# EAGLE design registers_miniboard_autorouted (EAGLE 9.5.2)
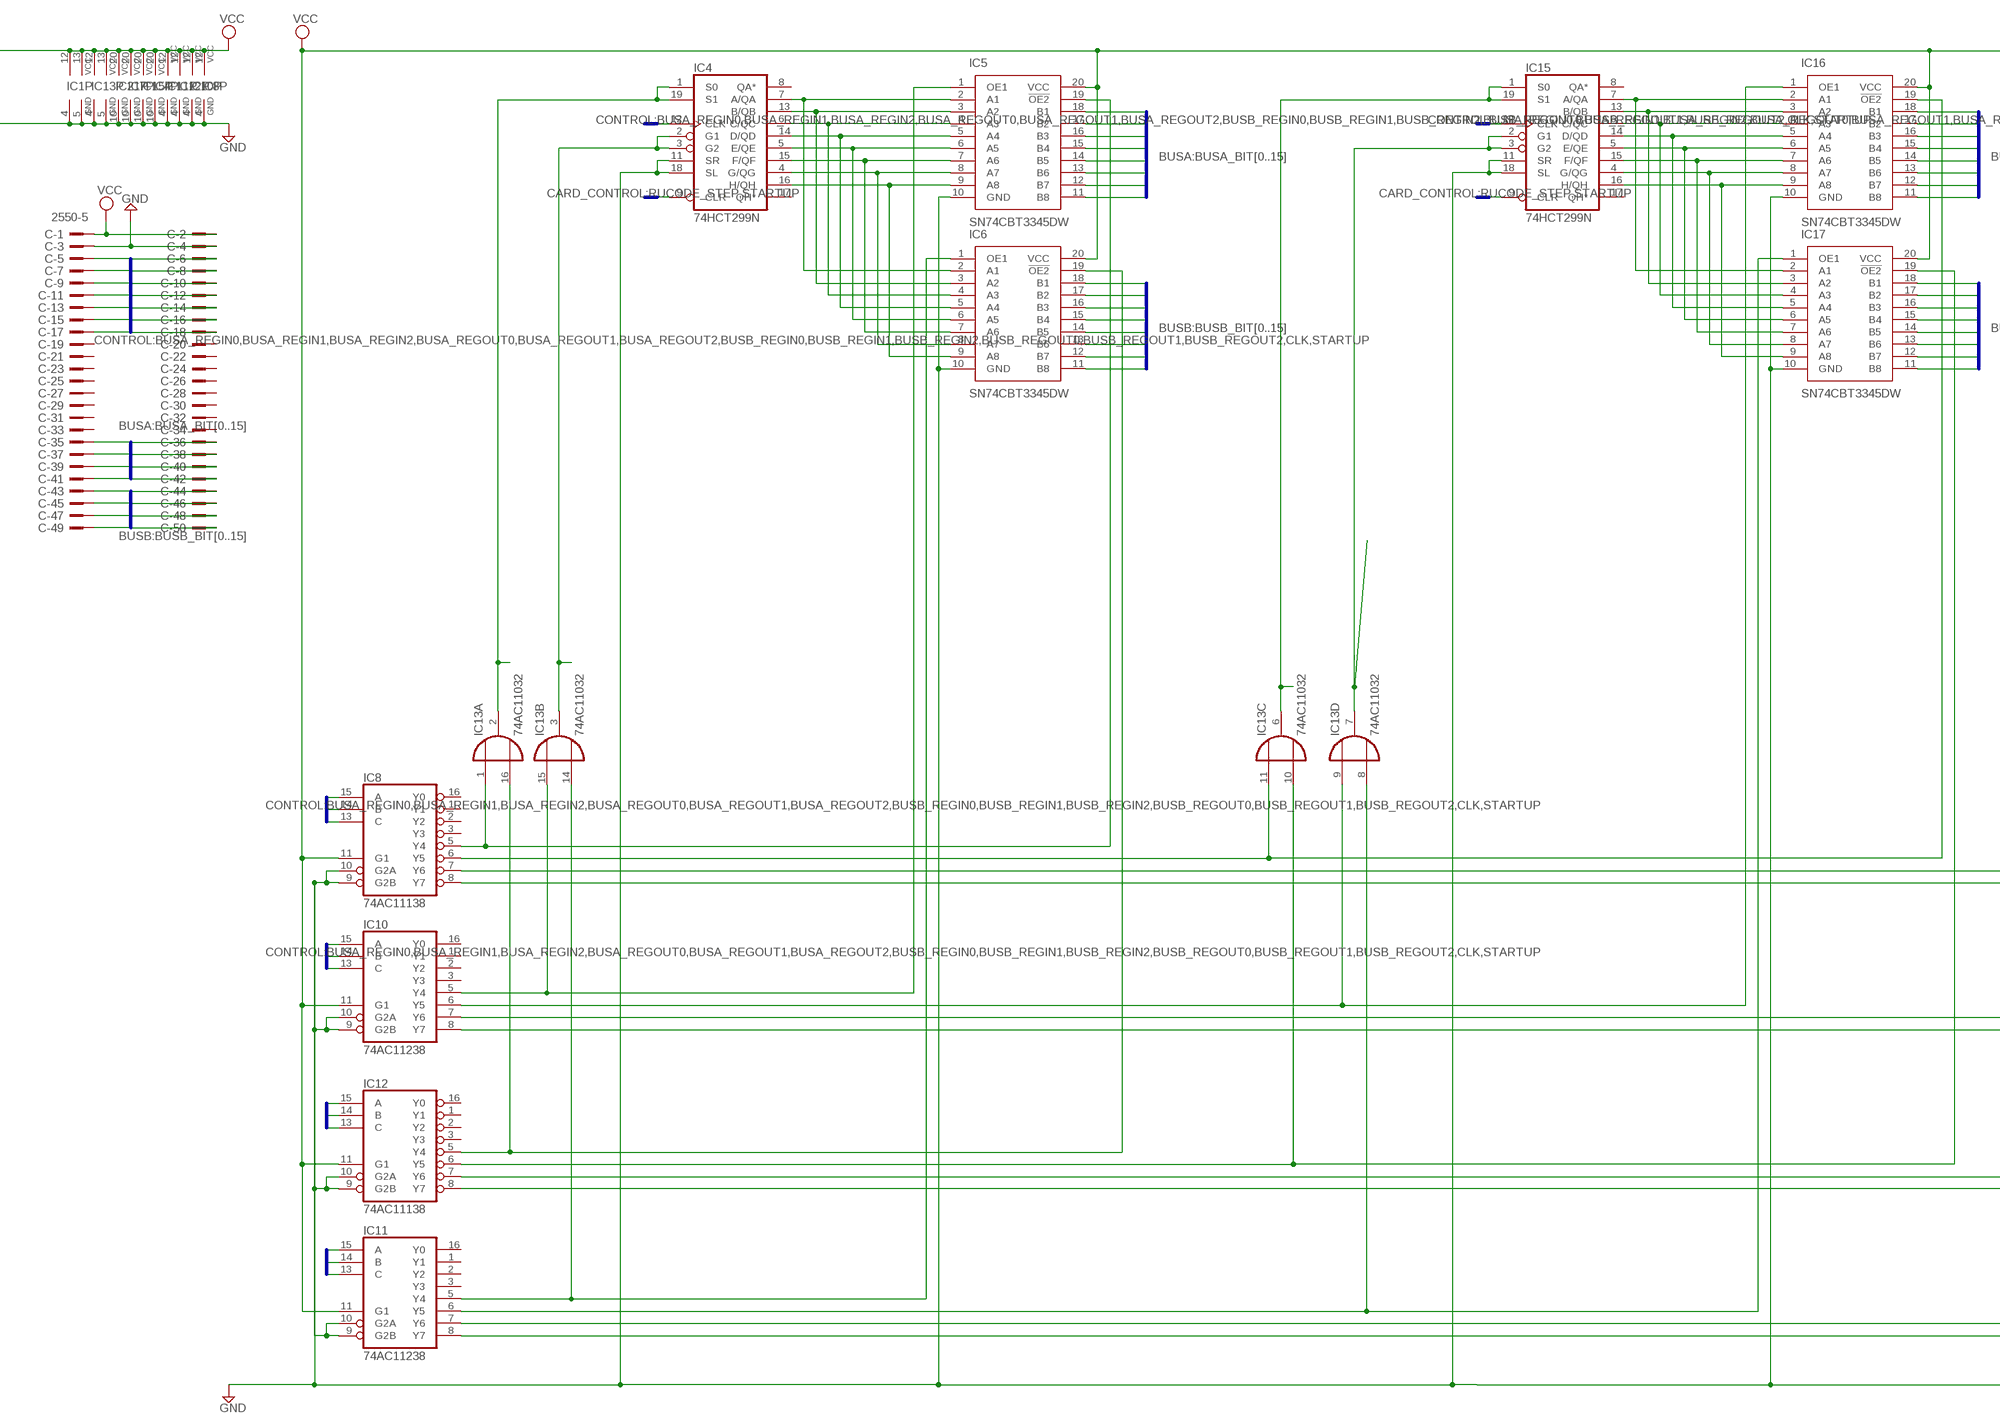
[diagram p0: schematic, sheet 1, part 1 of 2]
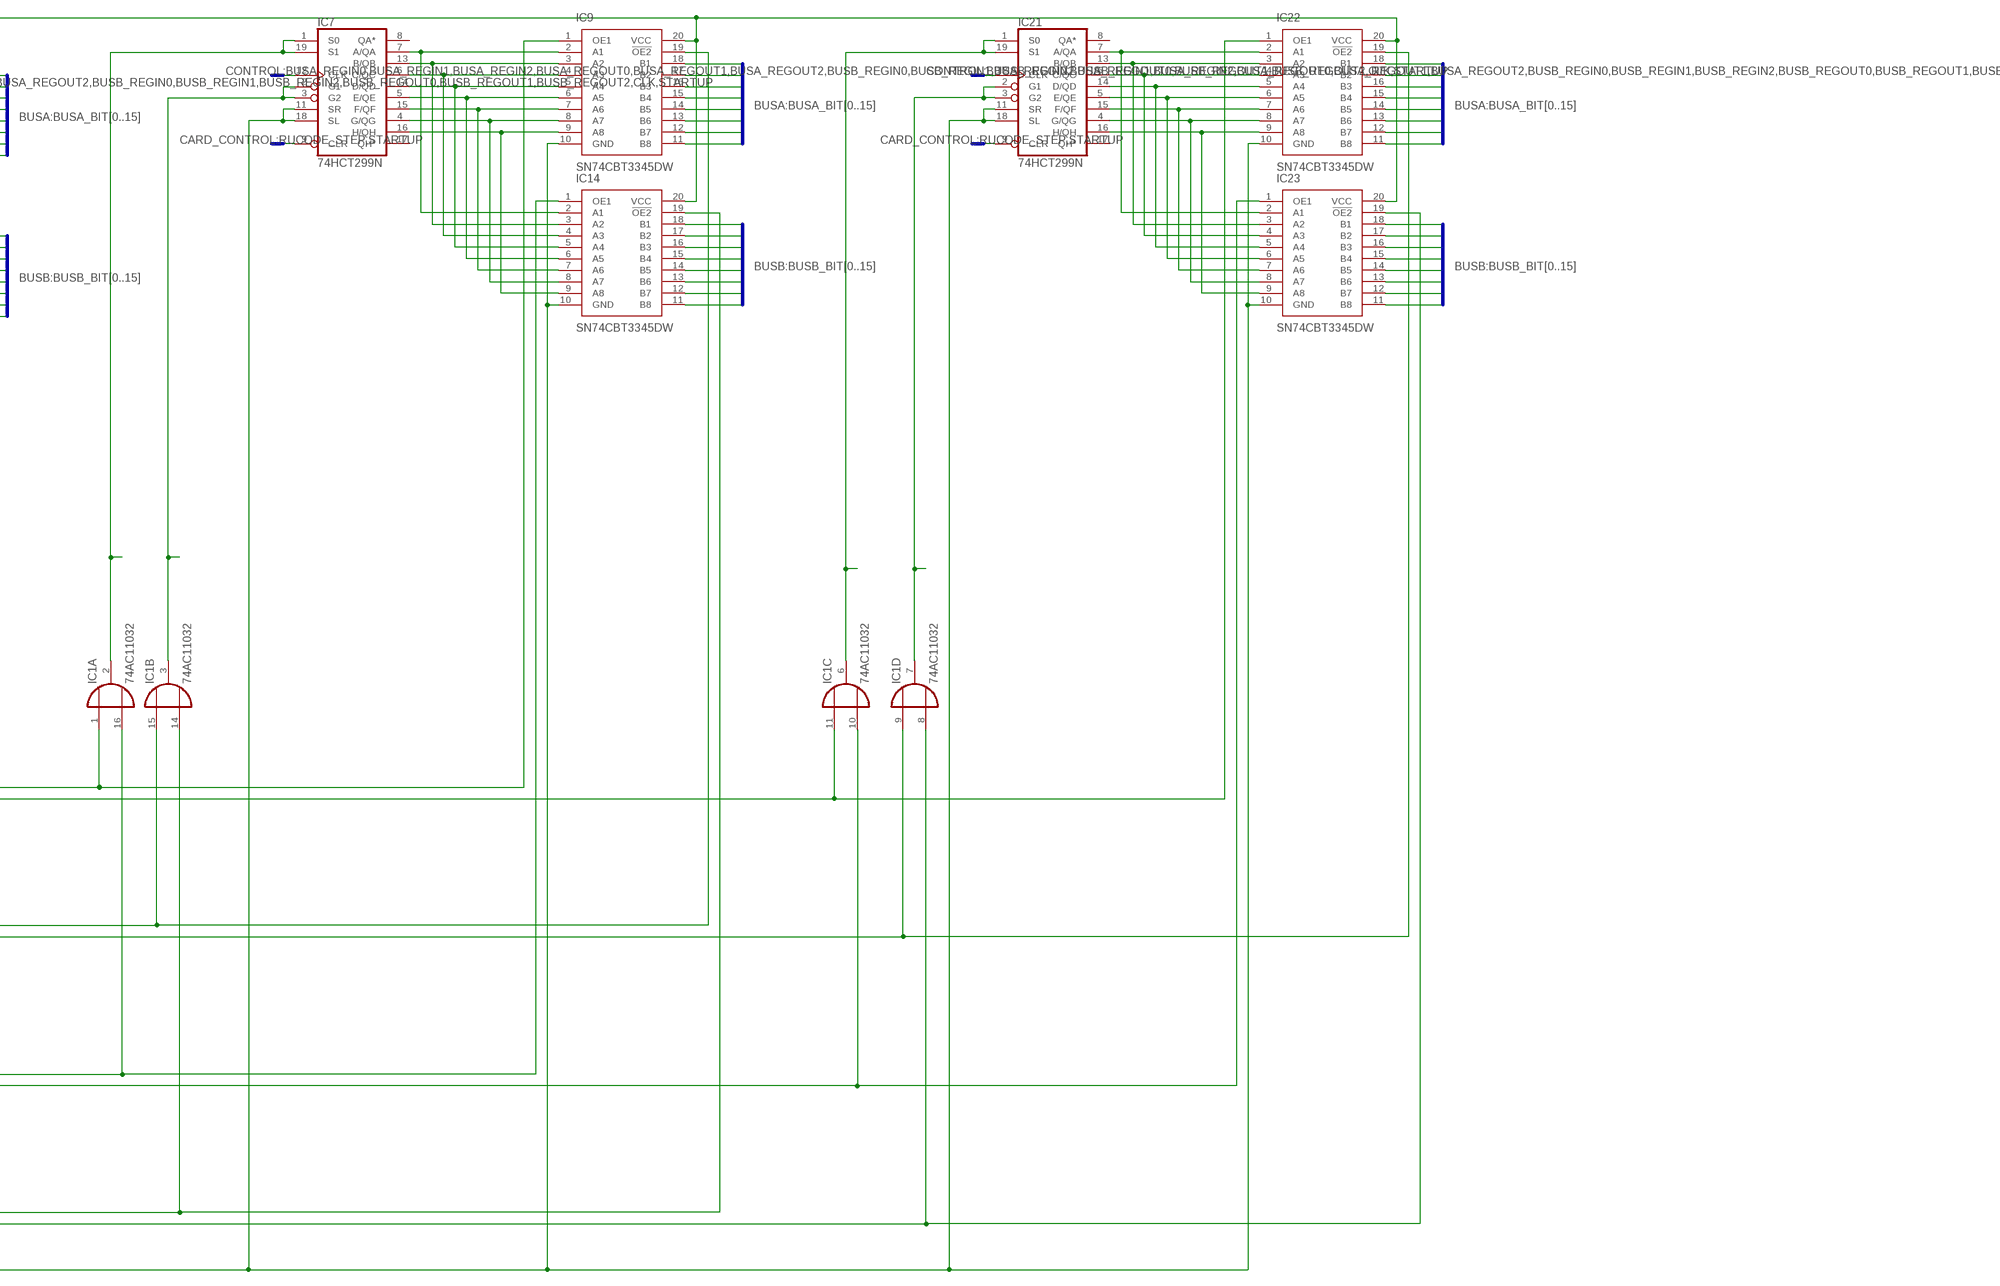
[diagram p1: schematic, sheet 1, part 2 of 2]

## Parts
C  2550-5  [PAK100/2500-5-50]
IC1  74AC11032  [DIL16]
IC4  74HCT299N  [DIL20]
IC5  SN74CBT3345DW  [SOIC127P1030X265-20N]
IC6  SN74CBT3345DW  [SOIC127P1030X265-20N]
IC7  74HCT299N  [DIL20]
IC8  74AC11138  [DIL16]
IC9  SN74CBT3345DW  [SOIC127P1030X265-20N]
IC10  74AC11238  [DIL16]
IC11  74AC11238  [DIL16]
IC12  74AC11138  [DIL16]
IC13  74AC11032  [DIL16]
IC14  SN74CBT3345DW  [SOIC127P1030X265-20N]
IC15  74HCT299N  [DIL20]
IC16  SN74CBT3345DW  [SOIC127P1030X265-20N]
IC17  SN74CBT3345DW  [SOIC127P1030X265-20N]
IC21  74HCT299N  [DIL20]
IC22  SN74CBT3345DW  [SOIC127P1030X265-20N]
IC23  SN74CBT3345DW  [SOIC127P1030X265-20N]

## Nets
BUSA_BIT0: C.35 IC5.18(B1) IC9.18(B1) IC16.18(B1) IC22.18(B1)
BUSA_BIT1: C.36 IC5.17(B2) IC9.17(B2) IC16.17(B2) IC22.17(B2)
BUSA_BIT2: C.37 IC5.16(B3) IC9.16(B3) IC16.16(B3) IC22.16(B3)
BUSA_BIT3: C.38 IC5.15(B4) IC9.15(B4) IC16.15(B4) IC22.15(B4)
BUSA_BIT4: C.39 IC5.14(B5) IC9.14(B5) IC16.14(B5) IC22.14(B5)
BUSA_BIT5: C.40 IC5.13(B6) IC9.13(B6) IC16.13(B6) IC22.13(B6)
BUSA_BIT6: C.41 IC5.12(B7) IC9.12(B7) IC16.12(B7) IC22.12(B7)
BUSA_BIT7: C.42 IC5.11(B8) IC9.11(B8) IC16.11(B8) IC22.11(B8)
BUSA_REGIN0: C.7 IC8.15(A)
BUSA_REGIN1: C.9 IC8.14(B)
BUSA_REGIN2: C.11 IC8.13(C)
BUSA_REGOUT0: C.13 IC10.15(A)
BUSA_REGOUT1: C.15 IC10.14(B)
BUSA_REGOUT2: C.17 IC10.13(C)
BUSB_BIT0: C.43 IC6.18(B1) IC14.18(B1) IC17.18(B1) IC23.18(B1)
BUSB_BIT1: C.44 IC6.17(B2) IC14.17(B2) IC17.17(B2) IC23.17(B2)
BUSB_BIT2: C.45 IC6.16(B3) IC14.16(B3) IC17.16(B3) IC23.16(B3)
BUSB_BIT3: C.46 IC6.15(B4) IC14.15(B4) IC17.15(B4) IC23.15(B4)
BUSB_BIT4: C.47 IC6.14(B5) IC14.14(B5) IC17.14(B5) IC23.14(B5)
BUSB_BIT5: C.48 IC6.13(B6) IC14.13(B6) IC17.13(B6) IC23.13(B6)
BUSB_BIT6: C.49 IC6.12(B7) IC14.12(B7) IC17.12(B7) IC23.12(B7)
BUSB_BIT7: C.50 IC6.11(B8) IC14.11(B8) IC17.11(B8) IC23.11(B8)
BUSB_REGIN0: C.8 IC12.15(A)
BUSB_REGIN1: C.10 IC12.14(B)
BUSB_REGIN2: C.12 IC12.13(C)
BUSB_REGOUT0: C.14 IC11.15(A)
BUSB_REGOUT1: C.16 IC11.14(B)
BUSB_REGOUT2: C.18 IC11.13(C)
CLK: C.5 IC4.12(CLK) IC7.12(CLK) IC15.12(CLK) IC21.12(CLK)
GND: C.3 C.4 IC1.4(P:GND) IC1.5(P:GND) IC4.10(GND) IC4.11(SR) IC4.18(SL) IC5.10(GND) IC6.10(GND) IC7.10(GND) IC7.11(SR) IC7.18(SL) IC8.4(GND) IC8.9(G2B) IC8.10(G2A) IC9.10(GND) IC10.4(GND) IC10.9(G2B) IC10.10(G2A) IC11.4(GND) IC11.9(G2B) IC11.10(G2A) IC12.4(GND) IC12.9(G2B) IC12.10(G2A) IC13.4(P:GND) IC13.5(P:GND) IC14.10(GND) IC15.10(GND) IC15.11(SR) IC15.18(SL) IC16.10(GND) IC17.10(GND) IC21.10(GND) IC21.11(SR) IC21.18(SL) IC22.10(GND) IC23.10(GND)
N$1: IC5.19(!OE2) IC8.5(Y4) IC13.1(A:I1)
N$5: IC4.7(A/QA) IC5.2(A1) IC6.2(A1)
N$6: IC4.13(B/QB) IC5.3(A2) IC6.3(A2)
N$7: IC4.6(C/QC) IC5.4(A3) IC6.4(A3)
N$8: IC4.14(D/QD) IC5.5(A4) IC6.5(A4)
N$9: IC4.5(E/QE) IC5.6(A5) IC6.6(A5)
N$10: IC4.15(F/QF) IC5.7(A6) IC6.7(A6)
N$11: IC4.4(G/QG) IC5.8(A7) IC6.8(A7)
N$15: IC4.16(H/QH) IC5.9(A8) IC6.9(A8)
N$22: IC7.7(A/QA) IC9.2(A1) IC14.2(A1)
N$23: IC7.13(B/QB) IC9.3(A2) IC14.3(A2)
N$24: IC7.6(C/QC) IC9.4(A3) IC14.4(A3)
N$25: IC7.14(D/QD) IC9.5(A4) IC14.5(A4)
N$28: IC7.5(E/QE) IC9.6(A5) IC14.6(A5)
N$34: IC5.1(OE1) IC10.5(Y4) IC13.15(B:I1)
N$35: IC7.15(F/QF) IC9.7(A6) IC14.7(A6)
N$36: IC7.4(G/QG) IC9.8(A7) IC14.8(A7)
N$37: IC7.16(H/QH) IC9.9(A8) IC14.9(A8)
N$41: IC15.7(A/QA) IC16.2(A1) IC17.2(A1)
N$42: IC15.13(B/QB) IC16.3(A2) IC17.3(A2)
N$43: IC15.6(C/QC) IC16.4(A3) IC17.4(A3)
N$44: IC15.14(D/QD) IC16.5(A4) IC17.5(A4)
N$45: IC15.5(E/QE) IC16.6(A5) IC17.6(A5)
N$46: IC15.15(F/QF) IC16.7(A6) IC17.7(A6)
N$47: IC15.4(G/QG) IC16.8(A7) IC17.8(A7)
N$48: IC15.16(H/QH) IC16.9(A8) IC17.9(A8)
N$63: IC21.7(A/QA) IC22.2(A1) IC23.2(A1)
N$64: IC21.13(B/QB) IC22.3(A2) IC23.3(A2)
N$65: IC21.6(C/QC) IC22.4(A3) IC23.4(A3)
N$66: IC21.14(D/QD) IC22.5(A4) IC23.5(A4)
N$67: IC21.5(E/QE) IC22.6(A5) IC23.6(A5)
N$68: IC21.15(F/QF) IC22.7(A6) IC23.7(A6)
N$69: IC21.4(G/QG) IC22.8(A7) IC23.8(A7)
N$70: IC21.16(H/QH) IC22.9(A8) IC23.9(A8)
N$123: IC6.1(OE1) IC11.5(Y4) IC13.14(B:I2)
N$124: IC6.19(!OE2) IC12.5(Y4) IC13.16(A:I2)
N$127: IC4.2(G1) IC4.3(G2) IC13.3(B:O)
N$128: IC4.1(S0) IC4.19(S1) IC13.2(A:O)
N$137: IC13.7(D:O) IC15.2(G1) IC15.3(G2)
N$138: IC13.6(C:O) IC15.1(S0) IC15.19(S1)
N$147: IC1.3(B:O) IC7.2(G1) IC7.3(G2)
N$148: IC1.2(A:O) IC7.1(S0) IC7.19(S1)
N$157: IC1.7(D:O) IC21.2(G1) IC21.3(G2)
N$158: IC1.6(C:O) IC21.1(S0) IC21.19(S1)
N$167: IC8.6(Y5) IC13.11(C:I1) IC16.19(!OE2)
N$168: IC12.6(Y5) IC13.10(C:I2) IC17.19(!OE2)
N$169: IC10.6(Y5) IC13.9(D:I1) IC16.1(OE1)
N$170: IC11.6(Y5) IC13.8(D:I2) IC17.1(OE1)
N$171: IC1.1(A:I1) IC8.7(Y6) IC9.1(OE1)
N$172: IC1.16(A:I2) IC12.7(Y6) IC14.1(OE1)
N$173: IC1.15(B:I1) IC9.19(!OE2) IC10.7(Y6)
N$174: IC1.14(B:I2) IC11.7(Y6) IC14.19(!OE2)
N$175: IC1.11(C:I1) IC8.8(Y7) IC22.1(OE1)
N$176: IC1.9(D:I1) IC10.8(Y7) IC22.19(!OE2)
N$177: IC1.8(D:I2) IC11.8(Y7) IC23.19(!OE2)
N$178: IC1.10(C:I2) IC12.8(Y7) IC23.1(OE1)
STARTUP: C.6 IC4.9(CLR) IC7.9(CLR) IC15.9(CLR) IC21.9(CLR)
VCC: C.1 C.2 IC1.12(P:VCC) IC1.13(P:VCC) IC4.20(VCC) IC5.20(VCC) IC6.20(VCC) IC7.20(VCC) IC8.11(G1) IC8.12(VCC) IC9.20(VCC) IC10.11(G1) IC10.12(VCC) IC11.11(G1) IC11.12(VCC) IC12.11(G1) IC12.12(VCC) IC13.12(P:VCC) IC13.13(P:VCC) IC14.20(VCC) IC15.20(VCC) IC16.20(VCC) IC17.20(VCC) IC21.20(VCC) IC22.20(VCC) IC23.20(VCC)
Unconnected: C.19 C.20 C.21 C.22 C.23 C.24 C.25 C.26 C.27 C.28 C.29 C.30 C.31 C.32 C.33 C.34 IC4.8(QA*) IC4.17(QH*) IC7.8(QA*) IC7.17(QH*) IC8.1(Y1) IC8.2(Y2) IC8.3(Y3) IC8.16(Y0) IC10.1(Y1) IC10.2(Y2) IC10.3(Y3) IC10.16(Y0) IC11.1(Y1) IC11.2(Y2) IC11.3(Y3) IC11.16(Y0) IC12.1(Y1) IC12.2(Y2) IC12.3(Y3) IC12.16(Y0) IC15.8(QA*) IC15.17(QH*) IC21.8(QA*) IC21.17(QH*)

## Buses
CONTROL:BUSA_REGIN0,BUSA_REGIN1,BUSA_REGIN2,BUSA_REGOUT0,BUSA_REGOUT1,BUSA_REGOUT2,BUSB_REGIN0,BUSB_REGIN1,BUSB_REGIN2,BUSB_REGOUT0,BUSB_REGOUT1,BUSB_REGOUT2,CLK,STARTUP
CARD_CONTROL:RUCODE_STEP,STARTUP
BUSA:BUSA_BIT[0..15]
BUSB:BUSB_BIT[0..15]

## Library data of the parts
C = con-3m:2550-: 3M (TM) Pak 100 4-Wall Header Source: 3M; OC_FARNELL: 1788696; OC_NEWARK: unknown
IC1 IC13 = 74ac-logic:74AC11032: Quadruple 2-input OR
IC4 IC7 IC15 IC21 = 74xx-eu:74*299: 8-bit universal SHIFT/STORAGE REGISTER
IC5 IC6 IC9 IC14 IC16 IC17 IC22 IC23 = SamacSys_Parts:SN74CBT3345DW: Texas Instruments SN74CBT3345DW, Bus Switch, 8 x 1:1, 4.5 5.5 V, 20-Pin SOIC Source: Datasheet <https://www.ti.com/lit/ds/symlink/sn74cbt3345.pdf>; DESCRIPTION: Texas Instruments SN74CBT3345DW, Bus Switch, 8 x 1:1, 4.5 5.5 V, 20-Pin SOIC; HEIGHT: 2.65mm; MANUFACTURER_NAME: Texas Instruments; MANUFACTURER_PART_NUMBER: SN74CBT3345DW
IC8 IC12 = 74ac-logic:74AC11138: 3 to 8 line DECODER/DEMULTIPLEXER
IC10 IC11 = 74ac-logic:74AC11238: 3 to 8 line DECODER/DEMULTIPLEXER

## Board
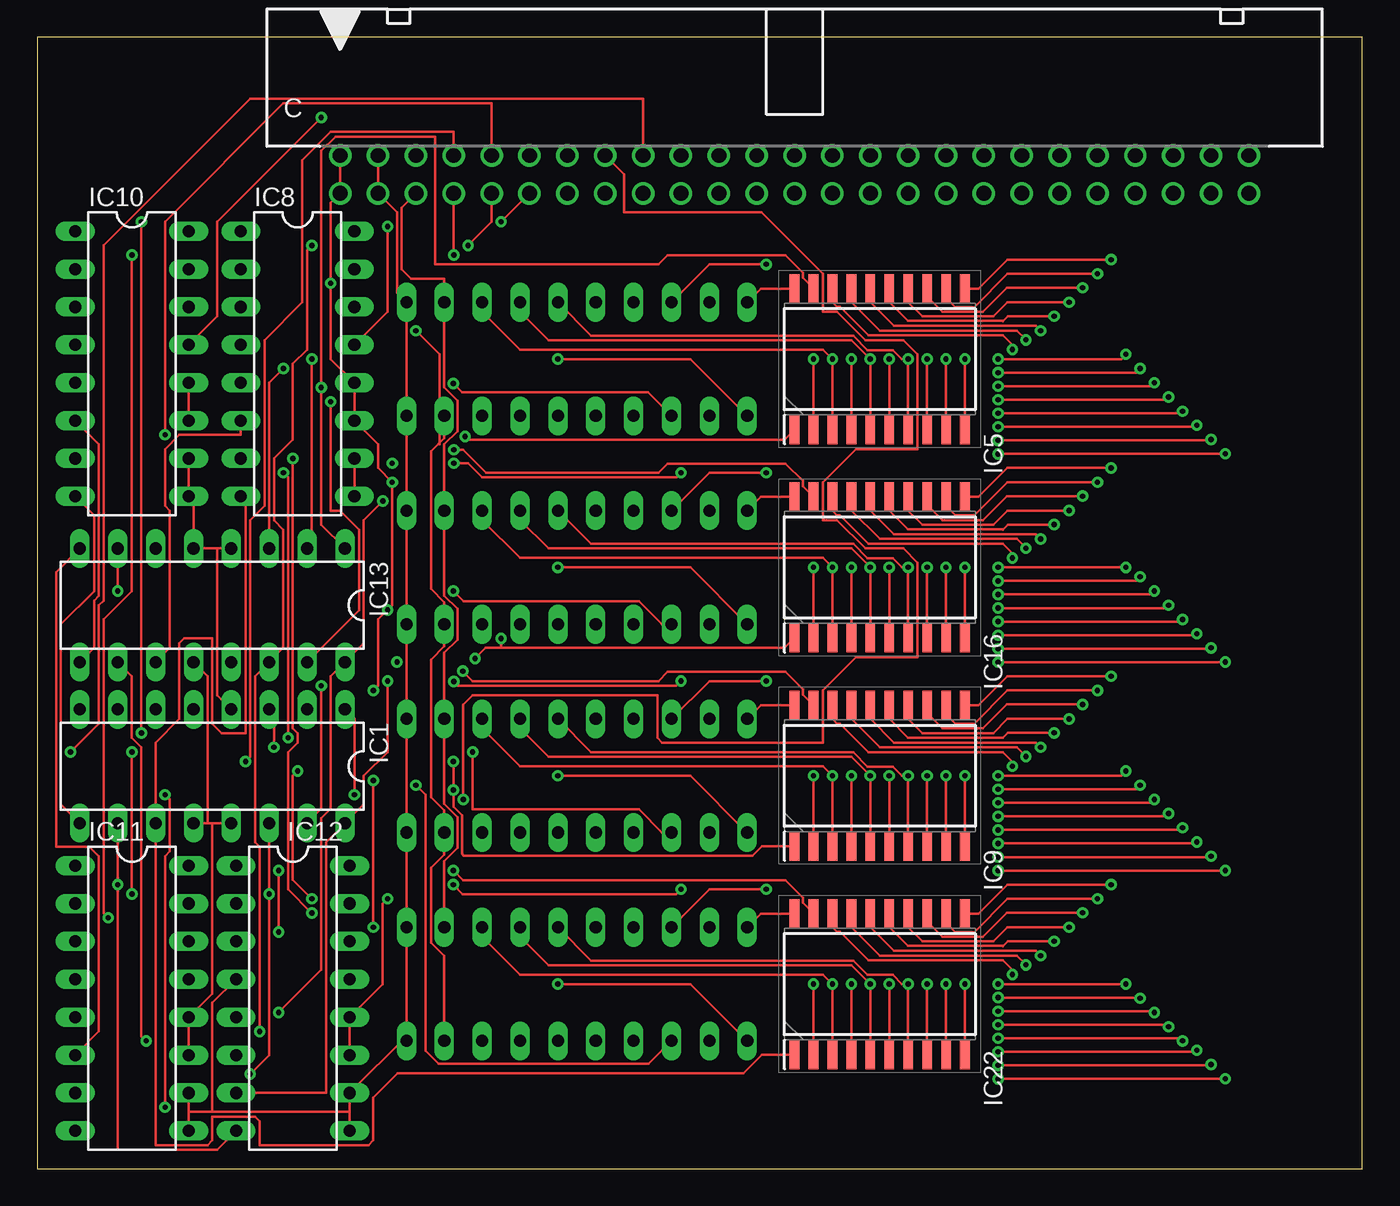
[diagram p2: board, top side]
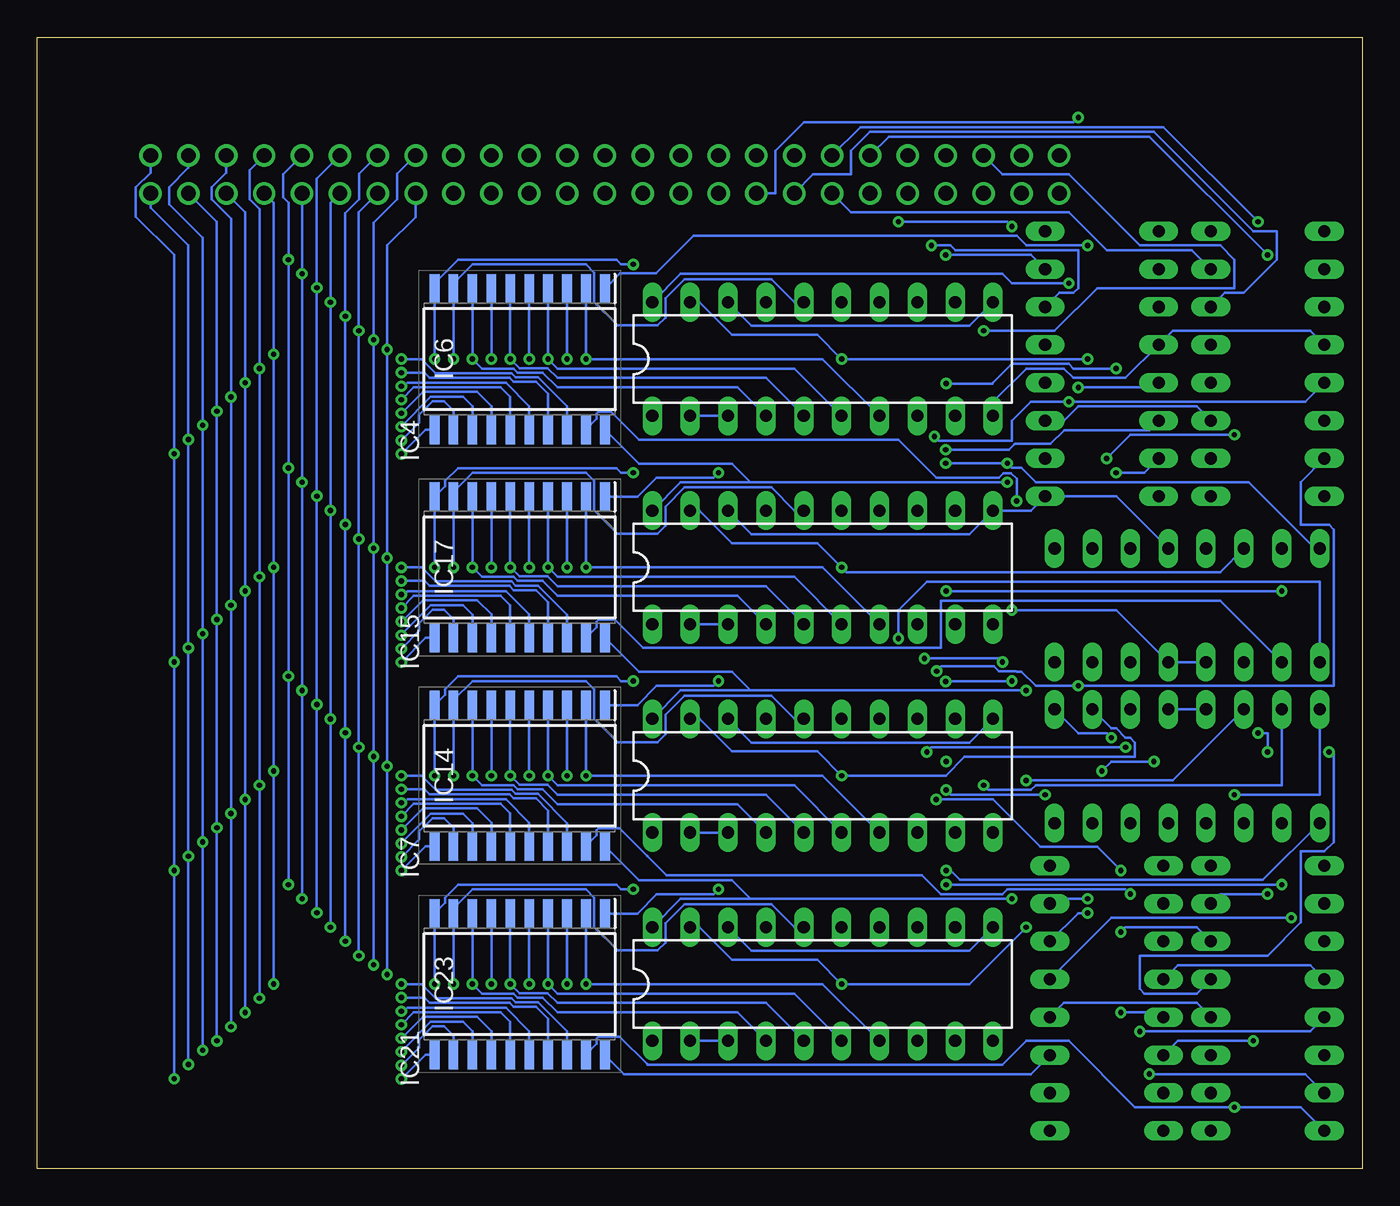
[diagram p3: board, bottom side, seen from below]

Size 88.88 x 75.87 mm. Coordinates in mm from the lower left corner, seen from the top.
Outline: 0,0 88.88,0 88.88,75.87 0,75.87 0,0
Copper layers (1*16): Top 0.035mm / dielectric 1.5mm / Bottom 0.035mm
Design rules "default *": minimum track width 6mil, minimum drill 0.35mm, track to track 6mil, track to pad 6mil, pad to pad 6mil, via to via 6mil, smd to smd 6mil, copper to edge 40mil, drill to drill 6mil, minimum pad ring 10mil, minimum via ring 8mil, stop-mask expansion 4mil, vias tented up to drill 0mil, thermal gap 10mil
tRestrict: area 63.5,59.7 to 86.4,64.8; area 86.4,59.7 to 88.9,64.8; area 64.8,6.3 to 80,62.2
bRestrict: area 63.5,59.7 to 86.4,64.8; area 86.4,59.7 to 88.9,64.8; area 64.8,6.3 to 80,61

### Footprints (pad centres in the part's own frame; a part is rotated, then mirrored left to right if it is on the bottom)
PAK100/2500-5-50 = drill 1 pad 1.422: 1 -30.48,-1.27; 2 -30.48,1.27; 3 -27.94,-1.27; 4 -27.94,1.27; 5 -25.4,-1.27; 6 -25.4,1.27; 7 -22.86,-1.27; 8 -22.86,1.27; 9 -20.32,-1.27; 10 -20.32,1.27; 11 -17.78,-1.27; 12 -17.78,1.27; 13 -15.24,-1.27; 14 -15.24,1.27; 15 -12.7,-1.27; 16 -12.7,1.27; 17 -10.16,-1.27; 18 -10.16,1.27; 19 -7.62,-1.27; 20 -7.62,1.27; 21 -5.08,-1.27; 22 -5.08,1.27; 23 -2.54,-1.27; 24 -2.54,1.27; 25 0,-1.27; 26 0,1.27; 27 2.54,-1.27; 28 2.54,1.27; 29 5.08,-1.27; 30 5.08,1.27; 31 7.62,-1.27; 32 7.62,1.27; 33 10.16,-1.27; 34 10.16,1.27; 35 12.7,-1.27; 36 12.7,1.27; 37 15.24,-1.27; 38 15.24,1.27; 39 17.78,-1.27; 40 17.78,1.27; 41 20.32,-1.27; 42 20.32,1.27; 43 22.86,-1.27; 44 22.86,1.27; 45 25.4,-1.27; 46 25.4,1.27; 47 27.94,-1.27; 48 27.94,1.27; 49 30.48,-1.27; 50 30.48,1.27
DIL16 = drill 0.813 long: 1 -8.89,-3.81; 2 -6.35,-3.81; 3 -3.81,-3.81; 4 -1.27,-3.81; 5 1.27,-3.81; 6 3.81,-3.81; 7 6.35,-3.81; 8 8.89,-3.81; 9 8.89,3.81; 10 6.35,3.81; 11 3.81,3.81; 12 1.27,3.81; 13 -1.27,3.81; 14 -3.81,3.81; 15 -6.35,3.81; 16 -8.89,3.81
DIL20 = drill 0.813 long: 1 -11.43,-3.81; 2 -8.89,-3.81; 3 -6.35,-3.81; 4 -3.81,-3.81; 5 -1.27,-3.81; 6 1.27,-3.81; 7 3.81,-3.81; 8 6.35,-3.81; 9 8.89,-3.81; 10 11.43,-3.81; 11 11.43,3.81; 12 8.89,3.81; 13 6.35,3.81; 14 3.81,3.81; 15 1.27,3.81; 16 -1.27,3.81; 17 -3.81,3.81; 18 -6.35,3.81; 19 -8.89,3.81; 20 -11.43,3.81
SOIC127P1030X265-20N = smd 1.95 x 0.65: 1 -4.725,5.715; 2 -4.725,4.445; 3 -4.725,3.175; 4 -4.725,1.905; 5 -4.725,0.635; 6 -4.725,-0.635; 7 -4.725,-1.905; 8 -4.725,-3.175; 9 -4.725,-4.445; 10 -4.725,-5.715; 11 4.725,-5.715; 12 4.725,-4.445; 13 4.725,-3.175; 14 4.725,-1.905; 15 4.725,-0.635; 16 4.725,0.635; 17 4.725,1.905; 18 4.725,3.175; 19 4.725,4.445; 20 4.725,5.715

### Placement (x,y rotation side)
C  50.8,66.67 0 top
IC1  11.75,26.99 180 top
IC4  36.2,54.29 0 bottom
IC5  56.52,54.29 90 top
IC6  56.52,54.29 270 bottom
IC7  36.2,26.35 0 bottom
IC8  17.46,53.98 270 top
IC9  56.52,26.35 90 top
IC10  6.35,53.98 270 top
IC11  6.35,11.43 270 top
IC12  17.14,11.43 270 top
IC13  11.75,37.78 180 top
IC14  56.52,26.35 270 bottom
IC15  36.2,40.32 0 bottom
IC16  56.52,40.32 90 top
IC17  56.52,40.32 270 bottom
IC21  36.2,12.38 0 bottom
IC22  56.52,12.38 90 top
IC23  56.52,12.38 270 bottom

### Tracks (layer width: path | path; a pad name or v marks a point on that pad's centre or on a via)
BUSA_BIT0  (via drill 0.35)
  Top 0.152: v65.41,54.93 65.41,55.24 64.77,55.88 55.77,55.88 53.86,57.78 53.66,57.78 53.34,58.1 IC5.18 | v65.41,40.96 65.41,41.27 64.77,41.91 55.77,41.91 53.86,43.81 53.66,43.81 53.34,44.13 IC16.18 | v65.41,26.99 65.41,27.3 64.77,27.94 55.77,27.94 53.86,29.84 53.66,29.84 53.34,30.16 IC9.18 | v65.41,13.02 65.41,13.34 64.77,13.97 55.77,13.97 53.86,15.88 53.66,15.88 53.34,16.19 IC22.18
  Bottom 0.152: v65.41,13.02 v65.41,26.99 v65.41,40.96 v65.41,54.93 65.41,61.91 63.5,63.82 C.35
BUSA_BIT1  (via drill 0.35)
  Top 0.152: v66.31,55.58 66.31,55.61 65.72,56.2 56.52,56.2 54.61,58.1 IC5.17 | v66.31,41.61 66.31,41.64 65.72,42.23 56.52,42.23 54.61,44.13 IC16.17 | v66.31,27.64 66.31,27.67 65.72,28.26 56.52,28.26 54.61,30.16 IC9.17 | v66.31,13.67 66.31,13.7 65.72,14.29 56.52,14.29 54.61,16.19 IC22.17
  Bottom 0.152: v66.31,13.67 v66.31,27.64 v66.31,41.61 v66.31,55.58 66.31,63.42 64.74,65 64.74,66.7 C.36
BUSA_BIT2  (via drill 0.35)
  Top 0.152: v67.31,56.2 66.99,56.52 57.47,56.52 55.88,58.1 IC5.16 | v67.31,42.23 66.99,42.55 57.47,42.55 55.88,44.13 IC16.16 | v67.31,28.26 66.99,28.57 57.47,28.57 55.88,30.16 IC9.16 | v67.31,14.29 66.99,14.61 57.47,14.61 55.88,16.19 IC22.16
  Bottom 0.152: v67.31,14.29 v67.31,28.26 v67.31,42.23 v67.31,56.2 67.31,64.14 C.37
BUSA_BIT3  (via drill 0.35)
  Top 0.152: v68.22,57.17 65.1,57.17 64.77,56.83 64.76,56.84 58.41,56.84 57.15,58.1 IC5.15 | v68.22,43.2 65.1,43.2 64.77,42.86 64.76,42.88 58.41,42.88 57.15,44.13 IC16.15 | v68.22,29.23 65.1,29.23 64.77,28.89 64.76,28.91 58.41,28.91 57.15,30.16 IC9.15 | v68.22,15.26 65.1,15.26 64.77,14.92 64.76,14.94 58.41,14.94 57.15,16.19 IC22.15
  Bottom 0.152: v68.22,15.26 v68.22,29.23 v68.22,43.2 v68.22,57.17 68.22,64.06 67.28,65 67.28,66.7 C.38
BUSA_BIT4  (via drill 0.35)
  Top 0.152: v69.22,58.1 65.09,58.1 64.14,57.15 59.37,57.15 58.42,58.1 IC5.14 | v69.22,44.13 65.09,44.13 64.14,43.18 59.37,43.18 58.42,44.13 IC16.14 | v69.22,30.16 65.09,30.16 64.14,29.21 59.37,29.21 58.42,30.16 IC9.14 | v69.22,16.19 65.09,16.19 64.14,15.24 59.37,15.24 58.42,16.19 IC22.14
  Bottom 0.152: v69.22,16.19 v69.22,30.16 v69.22,44.13 v69.22,58.1 69.22,64.77 C.39
BUSA_BIT5  (via drill 0.35)
  Top 0.152: IC5.13 59.69,58.5 60.72,57.47 63.44,57.47 65.04,59.07 v70.12,59.07 | IC16.13 59.69,44.53 60.72,43.5 63.44,43.5 65.04,45.1 v70.12,45.1 | IC9.13 59.69,30.56 60.72,29.53 63.44,29.53 65.04,31.13 v70.12,31.13 | IC22.13 59.69,16.59 60.72,15.56 63.44,15.56 65.04,17.16 v70.12,17.16
  Bottom 0.152: v70.12,17.16 v70.12,31.13 v70.12,45.1 v70.12,59.07 70.14,59.08 70.14,66.39 C.40
BUSA_BIT6  (via drill 0.35)
  Top 0.152: v71.12,60.01 65.09,60.01 62.85,57.77 61.59,57.77 60.96,58.41 IC5.12 | v71.12,46.04 65.09,46.04 62.85,43.8 61.59,43.8 60.96,44.44 IC16.12 | v71.12,32.07 65.09,32.07 62.85,29.83 61.59,29.83 60.96,30.47 IC9.12 | v71.12,18.1 65.09,18.1 62.85,15.86 61.59,15.86 60.96,16.5 IC22.12
  Bottom 0.152: v71.12,18.1 v71.12,32.07 v71.12,46.04 v71.12,60.01 C.41
BUSA_BIT7  (via drill 0.35)
  Top 0.152: v72.03,60.96 65.09,60.96 63.15,59.02 IC5.11 | v72.03,46.99 65.09,46.99 63.15,45.05 IC16.11 | v72.03,33.02 65.09,33.02 63.15,31.08 IC9.11 | v72.03,19.05 65.09,19.05 63.15,17.11 IC22.11
  Bottom 0.152: v72.03,19.05 v72.03,33.02 v72.03,46.99 v72.03,60.96 72.03,64.77 72.39,65.13 72.39,66.67 C.42
BUSA_REGIN0  (via drill 0.35)
  Top 0.152: C.7 v27.94,61.28
  Bottom 0.152: IC8.15 22.23,61.28 v27.94,61.28
BUSA_REGIN1  (via drill 0.35)
  Top 0.152: v28.89,61.91 30.48,63.5 C.9
  Bottom 0.152: IC8.14 20.32,58.74 19.37,58.74 19.05,59.05 19.05,61.59 27.3,61.59 27.62,61.91 v28.89,61.91
BUSA_REGIN2  (via drill 0.35)
  Top 0.152: IC8.13 23.5,57.47 v23.5,63.18 | C.11 v31.11,63.5
  Bottom 0.152: v23.5,63.18 23.81,63.5 v31.11,63.5
BUSA_REGOUT0
  Bottom 0.152: IC10.15 11.43,61.59 17.14,61.59 19.68,64.14 34.29,64.14 C.13
BUSA_REGOUT1
  Bottom 0.152: IC10.14 9.21,58.74 7.94,58.74 5.71,60.96 5.71,62.87 7.3,62.87 13.97,69.53 33.02,69.53 34.29,68.26 34.29,66.67 36.83,66.67 C.15
BUSA_REGOUT2  (via drill 0.35)
  Top 0.152: IC10.13 12.06,57.15 12.06,63.5 v19.05,70.48
  Bottom 0.152: v19.05,70.48 19.37,70.17 37.47,70.17 39.37,68.26 39.37,65.41 C.17
BUSB_BIT0  (via drill 0.35)
  Top 0.152: v64.45,12.38 v73.03,12.38 | v64.45,26.35 72.71,26.35 v73.03,26.67 | v64.45,40.32 v73.03,40.32 | v64.45,54.29 72.71,54.29 v73.03,54.61
  Bottom 0.152: IC6.18 53.34,51.12 55.3,53.08 56.8,53.08 57.07,53.35 62.15,53.35 63.09,54.29 v64.45,54.29 | IC17.18 53.34,37.15 55.3,39.11 56.8,39.11 57.07,39.38 62.15,39.38 63.09,40.32 v64.45,40.32 | IC14.18 53.34,23.18 55.3,25.14 56.8,25.14 57.07,25.41 62.15,25.41 63.09,26.35 v64.45,26.35 | IC23.18 53.34,9.21 55.3,11.17 56.8,11.17 57.07,11.44 62.15,11.44 63.09,12.38 v64.45,12.38 | v73.03,12.38 v73.03,26.67 v73.03,40.32 v73.03,54.61 73.03,64.77 C.43
BUSB_BIT1  (via drill 0.35)
  Top 0.152: v64.45,11.47 73.93,11.47 v73.98,11.43 | v64.45,25.44 73.7,25.44 v73.98,25.72 | v64.45,39.41 73.7,39.41 v73.98,39.69 | v64.45,53.38 73.7,53.38 v73.98,53.66
  Bottom 0.152: v64.45,53.38 62.91,53.38 62.57,53.05 57.2,53.05 56.92,52.77 55.42,52.77 54.61,51.96 IC6.17 | v64.45,39.41 62.91,39.41 62.57,39.08 57.2,39.08 56.92,38.8 55.42,38.8 54.61,37.99 IC17.17 | v64.45,25.44 62.91,25.44 62.57,25.11 57.2,25.11 56.92,24.83 55.42,24.83 54.61,24.02 IC14.17 | v64.45,11.47 62.91,11.47 62.57,11.14 57.2,11.14 56.92,10.86 55.42,10.86 54.61,10.05 IC23.17 | v73.98,11.43 v73.98,25.72 v73.98,39.69 v73.98,53.66 73.98,64.33 74.64,65 74.64,66.96 C.44
BUSB_BIT2  (via drill 0.35)
  Top 0.152: v64.45,10.56 74.84,10.56 v74.93,10.48 | v64.45,24.54 74.7,24.54 v74.93,24.77 | v64.45,38.51 74.7,38.51 v74.93,38.73 | v64.45,52.48 74.7,52.48 v74.93,52.7
  Bottom 0.152: IC6.16 55.88,51.14 57.44,52.7 64.05,52.7 64.28,52.48 v64.45,52.48 | IC17.16 55.88,37.17 57.44,38.73 64.05,38.73 64.28,38.51 v64.45,38.51 | IC14.16 55.88,23.2 57.44,24.77 64.05,24.77 64.28,24.54 v64.45,24.54 | IC23.16 55.88,9.23 57.44,10.79 64.05,10.79 64.28,10.56 v64.45,10.56 | v74.93,10.48 v74.93,24.77 v74.93,38.73 v74.93,52.7 74.93,64.14 C.45
BUSB_BIT3  (via drill 0.35)
  Top 0.152: v64.45,9.66 75.75,9.66 v75.88,9.53 | v64.45,23.63 75.7,23.63 v75.88,23.81 | v64.45,37.6 75.7,37.6 v75.88,37.78 | v64.45,51.57 75.7,51.57 v75.88,51.75
  Bottom 0.152: v64.45,51.57 63.62,52.4 57.78,52.4 57.15,51.77 IC6.15 | v64.45,37.6 63.62,38.43 57.78,38.43 57.15,37.8 IC17.15 | v64.45,23.63 63.62,24.46 57.78,24.46 57.15,23.82 IC14.15 | v64.45,9.66 63.62,10.49 57.78,10.49 57.15,9.86 IC23.15 | v75.88,9.53 v75.88,23.81 v75.88,37.78 v75.88,51.75 75.88,63.7 77.18,65 77.18,65.81 76.2,66.8 C.46
BUSB_BIT4  (via drill 0.35)
  Top 0.152: v64.45,8.75 76.66,8.75 v76.83,8.57 | v64.45,22.72 76.69,22.72 v76.83,22.86 | v64.45,36.69 76.69,36.69 v76.83,36.83 | v64.45,50.66 76.69,50.66 v76.83,50.8
  Bottom 0.152: IC6.14 58.42,51.14 59.37,52.09 63.01,52.09 v64.45,50.66 | IC17.14 58.42,37.17 59.37,38.12 63.01,38.12 v64.45,36.69 | IC14.14 58.42,23.2 59.37,24.16 63.01,24.16 v64.45,22.72 | IC23.14 58.42,9.23 59.37,10.19 63.01,10.19 v64.45,8.75 | v76.83,8.57 v76.83,22.86 v76.83,36.83 v76.83,50.8 76.83,63.5 C.47
BUSB_BIT5  (via drill 0.35)
  Top 0.152: v64.45,7.84 77.69,7.84 v77.79,7.94 | v64.45,21.81 77.69,21.81 v77.79,21.91 | v64.45,35.78 77.69,35.78 v77.79,35.88 | v64.45,49.75 77.69,49.75 v77.79,49.85
  Bottom 0.152: IC6.13 59.69,51.12 60.33,51.75 62.5,51.75 64.45,49.8 v64.45,49.75 | IC17.13 59.69,37.15 60.33,37.78 62.5,37.78 64.45,35.83 v64.45,35.78 | IC14.13 59.69,23.18 60.33,23.81 62.5,23.81 64.45,21.86 v64.45,21.81 | IC23.13 59.69,9.21 60.33,9.84 62.5,9.84 64.45,7.89 v64.45,7.84 | v77.79,7.94 v77.79,21.91 v77.79,35.88 v77.79,49.85 77.79,62.43 80.04,64.68 80.04,65.81 78.74,67.11 C.48
BUSB_BIT6  (via drill 0.35)
  Top 0.152: v64.45,6.93 78.69,6.93 v78.74,6.99 | v64.45,20.9 78.69,20.9 v78.74,20.95 | v64.45,34.87 78.69,34.87 v78.74,34.92 | v64.45,48.84 78.69,48.84 v78.74,48.9
  Bottom 0.152: v64.45,48.84 63.26,50.03 63.26,50.56 62.37,51.45 61.59,51.45 60.96,50.81 IC6.12 | v64.45,34.87 63.26,36.06 63.26,36.59 62.37,37.48 61.59,37.48 60.96,36.84 IC17.12 | v64.45,20.9 63.26,22.09 63.26,22.62 62.37,23.51 61.59,23.51 60.96,22.87 IC14.12 | v64.45,6.93 63.26,8.12 63.26,8.65 62.37,9.54 61.59,9.54 60.96,8.9 IC23.12 | v78.74,6.99 v78.74,20.95 v78.74,34.92 v78.74,48.9 78.74,61.91 81.28,64.45 C.49
BUSB_BIT7  (via drill 0.35)
  Top 0.152: v64.45,6.02 v79.68,6.02 v79.69,6.03 | v64.45,19.99 v79.68,19.99 v79.69,20 | v64.45,33.96 v79.68,33.96 v79.69,33.97 | v64.45,47.93 v79.68,47.93 v79.69,47.94
  Bottom 0.152: IC6.11 62.83,49.57 64.45,47.94 v64.45,47.93 | IC17.11 62.83,35.6 64.45,33.97 v64.45,33.96 | IC14.11 62.83,21.63 64.45,20 v64.45,19.99 | IC23.11 62.83,7.66 64.45,6.03 v64.45,6.02 | v79.69,6.03 v79.69,20 v79.69,33.97 v79.69,47.94 79.69,61.28 82.26,63.85 82.26,65.81 81.28,66.8 C.50
BUSB_REGIN0  (via drill 0.35)
  Top 0.152: v18.41,18.1 17.14,19.37 17.14,26.35 v17.46,26.67 | v13.97,27.3 14.29,27.62 14.29,43.5 15.24,44.45 15.24,55.56 17.78,58.1 17.78,67.63 19.68,69.53 27.94,69.53 C.8
  Bottom 0.152: IC12.15 20.64,18.1 v18.41,18.1 | v17.46,26.67 16.83,27.3 v13.97,27.3
BUSB_REGIN1  (via drill 0.35)
  Top 0.152: v18.41,17.14 16.83,18.73 16.83,27.94 17.46,28.57 17.46,29.21 17.14,29.53 v17.14,47.62 | v8.57,49.21 8.57,63.5 16.51,71.44 30.48,71.44 C.10
  Bottom 0.152: IC12.14 19.05,17.14 v18.41,17.14 | v17.14,47.62 15.56,49.21 v8.57,49.21
BUSB_REGIN2  (via drill 0.35)
  Top 0.152: v4.76,16.83 4.45,17.14 4.45,36.83 6.35,38.73 v6.35,61.28
  Bottom 0.152: IC12.13 16.83,16.83 v4.76,16.83 | v6.35,61.28 14.29,69.22 31.75,69.22 C.12
BUSB_REGOUT0  (via drill 0.35)
  Top 0.152: v6.35,27.94 v6.35,18.41 | v6.99,63.5 v6.99,29.21
  Bottom 0.152: IC11.15 9.53,18.41 v6.35,18.41 | v6.35,27.94 6.35,29.21 v6.99,29.21 | v6.99,63.5 13.34,69.85 33.66,69.85 C.14
BUSB_REGOUT1  (via drill 0.35)
  Top 0.152: v16.19,20 v16.19,15.88 | v28.57,24.77 28.57,31.11 29.21,31.75 41.59,31.75 41.59,28.89 41.91,28.57 52.7,28.57 52.7,32.07 54.93,34.29 59.05,34.29 59.05,40.64 58.1,41.59 55.56,41.59 53.66,43.5 52.7,43.5 52.7,46.04 54.93,48.26 59.05,48.26 59.05,54.61 58.1,55.56 55.56,55.56 53.66,57.47 52.7,57.47 52.7,60.01 48.58,64.14 39.37,64.14 39.37,66.67 C.16
  Bottom 0.152: IC11.14 11.11,16.19 15.88,16.19 v16.19,15.88 | v16.19,20 17.78,21.59 21.59,21.59 24.77,24.77 v28.57,24.77
BUSB_REGOUT2  (via drill 0.35)
  Top 0.152: v2.22,27.94 4.13,29.84 4.13,37.78 4.45,38.1 4.45,61.91 14.29,71.75 40.64,71.75 C.18
  Bottom 0.152: IC11.13 11.11,11.75 14.61,11.75 14.92,12.06 14.92,14.29 6.35,14.29 4.13,16.51 4.13,21.27 2.54,21.27 1.91,21.91 1.91,27.94 v2.22,27.94
CLK
  Top 0.152: IC21.12 27.3,20.62 28.19,21.51 28.19,23.57 27.3,24.46 IC7.12 27.3,34.59 28.19,35.48 28.19,37.54 27.3,38.43 IC15.12 27.3,48.56 28.19,49.45 28.19,51.51 27.3,52.4 IC4.12 27.3,59.69 25.08,59.69 24.45,60.33 24.45,64.45 C.5
GND  (via drill 0.35)
  Top 0.152: v48.9,60.64 45.09,60.64 IC4.18 | v62.23,54.29 IC5.10 | v62.23,40.32 IC16.10 | v62.23,26.35 IC9.10 | v62.23,12.38 IC22.10 | v48.9,46.67 45.09,46.67 IC15.18 | v48.9,32.7 45.09,32.7 IC7.18 | v48.9,18.73 45.09,18.73 IC21.18 | 24.77,8.89 IC21.11 IC7.10 IC7.11 IC15.10 IC15.11 IC4.10 IC4.11 24.13,58.74 24.13,64.14 C.3 C.4 | IC11.10 10.16,3.81 | 10.16,3.81 IC11.9 | 20.95,3.81 IC12.10 24.77,8.89 | 20.95,3.81 IC12.9 | 20.95,3.81 11.75,3.81 | 11.75,3.81 10.16,3.81 | IC12.4 11.75,11.11 11.75,3.81 | IC10.10 IC10.9 10.48,44.77 IC13.5 12.06,41.59 | IC13.4 12.06,41.59 | IC1.4 12.06,31.75 12.06,41.59 | IC8.10 IC8.9 | 24.77,8.89 IC21.10
  Bottom 0.152: IC4.18 40.96,56.52 26.35,56.52 IC4.11 | v48.9,60.64 49.73,60.64 50.04,60.95 60.65,60.95 61.44,60.16 61.44,60.17 62.23,59.37 IC6.10 v62.23,54.29 | v62.23,40.32 IC17.10 61.51,45.76 61.51,46.12 60.65,46.98 50.04,46.98 49.73,46.67 v48.9,46.67 | IC15.18 40.96,42.55 26.35,42.55 IC15.11 22.23,44.13 IC8.9 16.51,45.09 IC13.4 | IC7.18 40.96,28.57 26.35,28.57 IC7.11 | v62.23,26.35 IC14.10 61.51,31.79 61.51,32.15 60.65,33.01 50.04,33.01 49.73,32.7 v48.9,32.7 | IC21.18 40.96,14.61 26.35,14.61 IC21.11 | v62.23,12.38 IC23.10 61.51,17.82 61.51,18.18 60.65,19.04 50.04,19.04 49.73,18.73 v48.9,18.73 | IC11.4 3.49,13.65 12.38,13.65 IC12.4 | IC1.4 IC1.5 | IC10.4 3.49,56.2 12.7,56.2 IC8.4 15.88,53.02 19.37,53.02 20,53.66 22.54,53.66 24.77,51.44 IC4.10
N$1  (via drill 0.35)
  Top 0.152: IC5.19 51.35,59.73 51.35,60.09 50.19,61.25 42.29,61.25 41.69,60.64 26.67,60.64 26.67,69.22 20,69.22 19.05,68.26 v19.05,52.39 19.05,43.18 IC13.1
  Bottom 0.152: IC8.5 13.97,52.39 v19.05,52.39
N$5  (via drill 0.35)
  Top 0.152: v52.07,54.29 IC5.2
  Bottom 0.152: IC6.2 v52.07,54.29 36.2,54.29 IC4.7
N$6  (via drill 0.35)
  Top 0.152: IC5.3 v53.34,54.29 52.7,54.93 32.38,54.93 29.84,57.47 IC4.13
  Bottom 0.152: v53.34,54.29 IC6.3
N$7  (via drill 0.35)
  Top 0.152: v54.61,54.29 IC5.4
  Bottom 0.152: IC6.4 v54.61,54.29 53.98,53.66 38.1,53.66 IC4.6
N$8  (via drill 0.35)
  Top 0.152: IC5.5 v55.88,54.29 54.61,55.56 34.29,55.56 32.38,57.47 IC4.14
  Bottom 0.152: IC6.5 v55.88,54.29
N$9  (via drill 0.35)
  Top 0.152: v57.15,54.29 IC5.6
  Bottom 0.152: IC6.6 v57.15,54.29 56.54,53.69 54.64,53.69 53.98,53.02 40.01,53.02 IC4.5
N$10  (via drill 0.35)
  Top 0.152: IC5.7 v58.42,54.29 58.01,54.29 57.4,54.9 55.7,54.9 54.74,55.87 37.16,55.87 IC4.15
  Bottom 0.152: IC6.7 v58.42,54.29
N$11  (via drill 0.35)
  Top 0.152: v59.69,54.29 IC5.8
  Bottom 0.152: IC6.8 v59.69,54.29 59.05,53.66 56.95,53.66 56.67,53.38 54.97,53.38 53.98,52.39 41.91,52.39 IC4.4
N$15  (via drill 0.35)
  Top 0.152: IC5.9 v60.96,54.29
  Bottom 0.152: v60.96,54.29 IC6.9 60.96,59.37 59.69,60.64 52.07,60.64 51.52,60.09 51.52,58.11 49.96,56.55 47.26,56.55 46.74,57.07 46.74,58.37 45.45,59.65 39.64,59.65 38.09,58.1 IC4.16
N$22  (via drill 0.35)
  Top 0.152: v52.07,26.35 IC9.2
  Bottom 0.152: IC14.2 v52.07,26.35 36.2,26.35 IC7.7
N$23  (via drill 0.35)
  Top 0.152: IC9.3 v53.34,26.35 52.7,26.99 32.38,26.99 29.84,29.53 IC7.13
  Bottom 0.152: v53.34,26.35 IC14.3
N$24  (via drill 0.35)
  Top 0.152: v54.61,26.35 IC9.4
  Bottom 0.152: IC14.4 v54.61,26.35 53.98,25.72 38.1,25.72 IC7.6
N$25  (via drill 0.35)
  Top 0.152: IC9.5 v55.88,26.35 54.61,27.62 34.29,27.62 32.38,29.53 IC7.14
  Bottom 0.152: IC14.5 v55.88,26.35
N$28  (via drill 0.35)
  Top 0.152: v57.15,26.35 IC9.6
  Bottom 0.152: IC14.6 v57.15,26.35 56.54,25.75 54.64,25.75 53.98,25.08 40.01,25.08 IC7.5
N$34  (via drill 0.35)
  Top 0.152: IC5.1 50.13,48.9 28.89,48.9 v28.69,49.09 | IC13.15 21.59,37.47 21.59,42.86 20.32,44.13 19.68,44.13 v19.68,51.44
  Bottom 0.152: v28.69,49.09 28.42,48.82 23.52,48.82 23.5,48.9 23.5,50.16 22.23,51.44 v19.68,51.44 3.81,51.44 IC10.5
N$35  (via drill 0.35)
  Top 0.152: IC9.7 v58.42,26.35 58.01,26.35 57.4,26.96 55.7,26.96 54.74,27.93 37.16,27.93 IC7.15
  Bottom 0.152: IC14.7 v58.42,26.35
N$36  (via drill 0.35)
  Top 0.152: v59.69,26.35 IC9.8
  Bottom 0.152: IC14.8 v59.69,26.35 59.05,25.72 56.95,25.72 56.67,25.44 54.97,25.44 53.98,24.45 41.91,24.45 IC7.4
N$37  (via drill 0.35)
  Top 0.152: v60.96,26.35 IC9.9
  Bottom 0.152: v60.96,26.35 IC14.9 60.96,31.43 59.69,32.7 52.07,32.7 51.52,32.15 51.52,30.17 49.96,28.61 47.26,28.61 46.74,29.13 46.74,30.43 45.45,31.71 39.64,31.71 38.09,30.16 IC7.16
N$41  (via drill 0.35)
  Top 0.152: v52.07,40.32 IC16.2
  Bottom 0.152: IC17.2 v52.07,40.32 36.2,40.32 IC15.7
N$42  (via drill 0.35)
  Top 0.152: IC16.3 v53.34,40.32 52.7,40.96 32.38,40.96 29.84,43.5 IC15.13
  Bottom 0.152: v53.34,40.32 IC17.3
N$43  (via drill 0.35)
  Top 0.152: v54.61,40.32 IC16.4
  Bottom 0.152: IC17.4 v54.61,40.32 53.98,39.69 38.1,39.69 IC15.6
N$44  (via drill 0.35)
  Top 0.152: IC16.5 v55.88,40.32 54.61,41.59 34.29,41.59 32.38,43.5 IC15.14
  Bottom 0.152: IC17.5 v55.88,40.32
N$45  (via drill 0.35)
  Top 0.152: v57.15,40.32 IC16.6
  Bottom 0.152: IC17.6 v57.15,40.32 56.54,39.72 54.64,39.72 53.98,39.05 40.01,39.05 IC15.5
N$46  (via drill 0.35)
  Top 0.152: IC16.7 v58.42,40.32 58.01,40.32 57.4,40.93 55.7,40.93 54.74,41.9 37.16,41.9 IC15.15
  Bottom 0.152: IC17.7 v58.42,40.32
N$47  (via drill 0.35)
  Top 0.152: v59.69,40.32 IC16.8
  Bottom 0.152: IC17.8 v59.69,40.32 59.05,39.69 56.95,39.69 56.67,39.41 54.97,39.41 53.98,38.42 41.91,38.42 IC15.4
N$48  (via drill 0.35)
  Top 0.152: v60.96,40.32 IC16.9
  Bottom 0.152: v60.96,40.32 IC17.9 60.96,45.4 59.69,46.67 52.07,46.67 51.52,46.12 51.52,44.14 49.96,42.58 47.26,42.58 46.74,43.1 46.74,44.4 45.45,45.68 39.64,45.68 38.09,44.13 IC15.16
N$63  (via drill 0.35)
  Top 0.152: v52.07,12.38 IC22.2
  Bottom 0.152: IC23.2 v52.07,12.38 36.2,12.38 IC21.7
N$64  (via drill 0.35)
  Top 0.152: IC22.3 v53.34,12.38 52.7,13.02 32.38,13.02 29.84,15.56 IC21.13
  Bottom 0.152: v53.34,12.38 IC23.3
N$65  (via drill 0.35)
  Top 0.152: v54.61,12.38 IC22.4
  Bottom 0.152: IC23.4 v54.61,12.38 53.98,11.75 38.1,11.75 IC21.6
N$66  (via drill 0.35)
  Top 0.152: IC22.5 v55.88,12.38 54.61,13.65 34.29,13.65 32.38,15.56 IC21.14
  Bottom 0.152: IC23.5 v55.88,12.38
N$67  (via drill 0.35)
  Top 0.152: v57.15,12.38 IC22.6
  Bottom 0.152: IC23.6 v57.15,12.38 56.54,11.78 54.64,11.78 53.98,11.11 40.01,11.11 IC21.5
N$68  (via drill 0.35)
  Top 0.152: IC22.7 v58.42,12.38 58.01,12.38 57.4,12.99 55.7,12.99 54.74,13.96 37.16,13.96 IC21.15
  Bottom 0.152: IC23.7 v58.42,12.38
N$69  (via drill 0.35)
  Top 0.152: v59.69,12.38 IC22.8
  Bottom 0.152: IC23.8 v59.69,12.38 59.05,11.75 56.95,11.75 56.67,11.47 54.97,11.47 53.98,10.48 41.91,10.48 IC21.4
N$70  (via drill 0.35)
  Top 0.152: v60.96,12.38 IC22.9
  Bottom 0.152: v60.96,12.38 IC23.9 60.96,17.46 59.69,18.73 52.07,18.73 51.52,18.18 51.52,16.2 49.96,14.64 47.26,14.64 46.74,15.16 46.74,16.46 45.45,17.74 39.64,17.74 38.09,16.19 IC21.16
N$123  (via drill 0.35)
  Top 0.152: v18.41,61.91 18.1,61.59 18.1,54.93 17.14,53.98 17.14,48.9 15.88,47.62 15.88,43.5 16.51,42.86 16.51,34.92 IC13.14 14.61,33.02 14.61,21.91 14.92,21.59 v14.92,9.21
  Bottom 0.152: IC6.1 49.78,60.04 47.37,60.04 44.86,62.55 23.18,62.55 22.54,61.91 v18.41,61.91 | IC11.5 3.49,9.21 v14.92,9.21
N$124  (via drill 0.35)
  Top 0.152: v16.19,10.48 19.05,13.34 19.05,23.5 19.68,24.13 19.68,33.02 IC13.16 21.91,35.24 21.91,43.5 v23.18,44.77
  Bottom 0.152: IC6.19 51.35,50.28 51.35,50.64 51.22,50.77 50.38,50.77 48.5,48.9 31.11,48.9 28.56,46.34 24.37,46.34 24.06,46.64 23.56,46.64 23.18,46.26 v23.18,44.77 | IC12.5 13.65,10.48 v16.19,10.48
N$127  (via drill 0.35)
  Top 0.152: IC4.3 40.96,52.07 28.49,52.07 v27.91,52.65 | IC13.3 15.56,52.7 v16.51,53.66
  Bottom 0.152: IC4.2 IC4.3 | v27.91,52.65 24.81,52.65 24.77,52.7 23.5,53.98 19.68,53.98 19.37,53.66 v16.51,53.66
N$128  (via drill 0.35)
  Top 0.152: v34.92,54.29 43.81,54.29 IC4.1 | IC13.2 18.41,41.91 v18.41,54.29
  Bottom 0.152: IC4.19 44.46,58.1 42.28,55.92 36.55,55.92 v34.92,54.29 v18.41,54.29
N$137  (via drill 0.35)
  Top 0.152: IC15.3 41.92,36.51 40.37,38.06 28.59,38.06 v27.91,38.73 | v5.4,38.73 IC13.7
  Bottom 0.152: IC15.2 IC15.3 | v27.91,38.73 v5.4,38.73
N$138  (via drill 0.35)
  Top 0.152: v34.92,40.32 43.81,40.32 IC15.1
  Bottom 0.152: IC15.19 44.46,44.13 42.28,41.95 36.55,41.95 v34.92,40.32 34.61,40.01 9.53,40.01 IC13.6
N$147  (via drill 0.35)
  Top 0.152: IC7.3 41.92,22.54 40.37,24.09 29.21,24.09 v29.21,27.94 | IC1.3 15.88,30.48 v15.88,28.26
  Bottom 0.152: IC7.2 IC7.3 | v29.21,27.94 28.89,28.26 v15.88,28.26
N$148  (via drill 0.35)
  Top 0.152: v34.92,26.35 43.81,26.35 IC7.1
  Bottom 0.152: IC7.19 44.46,30.16 42.28,27.98 36.55,27.98 v34.92,26.35 27.94,26.35 26.67,27.62 15.24,27.62 15.24,28.57 15.56,28.89 15.88,28.89 16.51,29.53 16.83,29.53 IC1.2
N$157  (via drill 0.35)
  Top 0.152: v25.4,25.72 26.04,25.08 26.04,12.7 26.04,12.22 26.04,7.92 26.94,7.02 41,7.02 IC21.3
  Bottom 0.152: IC21.2 IC21.3 | IC1.7 5.4,25.72 21.91,25.72 22.23,25.4 25.08,25.4 v25.4,25.72
N$158  (via drill 0.35)
  Top 0.152: v34.92,12.38 43.81,12.38 IC21.1 | v22.54,16.19 v22.54,26.04
  Bottom 0.152: IC21.19 44.46,16.19 42.28,14.01 36.55,14.01 v34.92,12.38 26.35,12.38 v22.54,16.19 | IC1.6 12.7,26.04 v22.54,26.04
N$167  (via drill 0.35)
  Top 0.152: IC16.19 51.35,45.76 51.35,46.12 50.19,47.28 42.29,47.28 41.69,46.67 30.12,46.67 28.57,48.22 v27.94,48.22 | IC13.11 8.89,34.92 8.89,44.13 8.57,44.45 8.57,48.26 9.53,49.21 13.65,49.21 IC8.6
  Bottom 0.152: IC8.6 14.29,49.53 19.99,49.53 20.91,48.61 23.26,48.61 23.34,48.58 23.69,48.22 v27.94,48.22
N$168  (via drill 0.35)
  Top 0.152: v7.3,8.57 6.99,8.89 6.99,28.26 6.35,28.89 6.35,33.02 IC13.10
  Bottom 0.152: IC17.19 51.35,36.31 51.35,36.67 51.22,36.8 50.14,36.8 48.26,34.92 28.26,34.92 28.26,38.1 9.53,38.1 IC13.10 | IC12.6 12.38,8.57 v7.3,8.57
N$169  (via drill 0.35)
  Top 0.152: IC16.1 50.13,34.92 31.11,34.92 | v29.38,34.22 30.08,34.92 31.11,34.92 | IC13.9 3.81,34.92 3.81,38.1 4.13,38.42 4.13,48.58 IC10.6 | 31.11,34.92 v31.11,35.56
  Bottom 0.152: IC13.9 2.86,39.37 29.21,39.37 31.11,37.47 v31.11,35.56 | v29.38,34.22 24.38,34.22 v24.13,33.97
N$170  (via drill 0.35)
  Top 0.152: v43.18,46.67 42.88,46.37 29.83,46.37 28.89,47.31 v27.94,47.31 | IC11.6 4.13,9.21 4.13,20.95 3.49,21.59 1.27,21.59 1.27,40.01 IC13.8
  Bottom 0.152: v43.18,46.67 43.51,46.34 47.33,46.34 48.63,45.05 IC17.1 | v27.94,47.31 v23.81,47.31 23.5,46.99 22.86,46.99 21.91,46.04 7.62,46.04 3.17,41.59 IC13.8
N$171  (via drill 0.35)
  Top 0.152: IC9.1 48.63,21.63 47.99,20.99 28.61,20.99 28.5,21.11 28.5,23.7 27.91,24.28 v27.91,25.4 v27.91,27.3 | v16.51,46.67 16.83,46.35 v16.83,28.89 | IC1.1 21.27,30.16 v21.27,25.08
  Bottom 0.152: v27.91,25.4 27.59,25.08 v21.27,25.08 | IC8.7 14.61,46.67 v16.51,46.67 | v16.83,28.89 17.14,29.21 19.05,29.21 IC1.1
N$172  (via drill 0.35)
  Top 0.152: v43.18,32.7 42.86,32.38 28.23,32.38 v27.94,32.67 | v23.5,32.7 23.5,27.94 21.91,26.35 21.91,24.45 IC1.16 19.37,21.91 19.37,5.08 IC12.7
  Bottom 0.152: v43.18,32.7 43.51,32.37 47.33,32.37 48.63,31.08 IC14.1 | v27.94,32.67 23.52,32.67 v23.5,32.7
N$173  (via drill 0.35)
  Top 0.152: IC9.19 51.35,31.79 51.35,32.15 50.19,33.31 42.29,33.31 41.69,32.7 29.21,32.7 v28.55,33.37 | IC1.15 19.05,24.13 v19.05,32.38
  Bottom 0.152: v28.55,33.37 28.23,33.68 24.7,33.68 24.38,33.37 23.25,33.37 23.18,33.34 22.86,33.34 21.91,32.38 v19.05,32.38 1.91,32.38 1.91,42.86 2.22,43.18 4.13,43.18 4.13,46.04 IC10.7
N$174  (via drill 0.35)
  Top 0.152: v14.29,6.35 15.56,7.62 v15.56,18.41 IC1.14
  Bottom 0.152: IC14.19 51.35,22.34 51.35,22.7 51.22,22.83 49.83,22.83 47.99,20.99 47.94,20.95 46.67,19.68 29.53,19.68 28.26,18.41 24.13,18.41 23.81,18.73 15.88,18.73 v15.56,18.41 | IC11.7 3.81,6.35 v14.29,6.35
N$175
  Top 0.152: IC22.1 48.63,7.66 47.36,6.39 24.17,6.39 22.54,4.76 22.54,1.91 22.23,1.59 14.92,1.59 14.92,3.17 14.61,3.49 11.75,3.49 11.75,1.91 11.43,1.59 7.94,1.59 IC1.11 7.94,28.57 9.53,30.16 9.53,35.24 9.84,35.56 11.75,35.56 11.75,29.84 12.38,29.21 13.97,29.21 13.97,44.77 IC8.8
N$176  (via drill 0.35)
  Top 0.152: IC22.19 51.35,17.82 51.35,18.18 50.19,19.34 28.57,19.34 v27.91,20 | IC10.8 3.81,43.81 3.81,38.73 1.59,36.51 1.59,24.45 IC1.9
  Bottom 0.152: IC1.9 6.67,19.37 26.99,19.37 27.62,20 v27.91,20
N$177  (via drill 0.35)
  Top 0.152: v8.57,25.08 8.89,24.77 8.89,21.27 8.57,20.95 v8.57,4.13
  Bottom 0.152: IC23.19 51.35,8.37 51.35,8.73 51.22,8.86 49.83,8.86 47.99,7.02 47.94,6.99 24.13,6.99 22.54,8.57 19.68,8.57 15.24,4.13 v8.57,4.13 4.13,4.13 IC11.8 | IC1.8 2.86,25.08 v8.57,25.08
N$178  (via drill 0.35)
  Top 0.152: v43.18,18.73 42.86,18.41 28.55,18.41 v27.91,19.05 | IC12.8 12.06,1.27 5.4,1.27 v5.4,19.05 IC1.10
  Bottom 0.152: v43.18,18.73 43.51,18.4 47.33,18.4 48.63,17.11 IC23.1 | v5.4,19.05 v27.91,19.05
STARTUP  (via drill 0.35)
  Top 0.152: IC21.9 27.3,14.28 26.42,15.16 26.42,20.17 27.3,21.06 IC7.9 27.3,24.03 26.42,24.92 26.42,34.14 27.3,35.03 IC15.9 27.3,38 26.42,38.89 26.42,48.11 26.94,48.63 | IC4.9 27.3,49 26.94,48.63 | v25.4,56.2 26.99,54.61 26.99,48.58 26.94,48.63
  Bottom 0.152: C.6 24.13,66.67 19.68,66.67 14.92,61.91 9.53,61.91 8.57,60.96 8.57,59.05 17.78,59.05 20.64,56.2 v25.4,56.2
VCC  (via drill 0.35)
  Top 0.152: IC15.20 48.54,45.05 IC16.20 | IC7.20 48.54,31.08 IC9.20 | IC21.20 48.54,17.11 IC22.20 | IC4.20 48.54,59.02 IC5.20 | IC12.11 IC12.12 23.18,12.38 23.18,17.78 v23.5,18.1 | IC11.11 IC11.12 11.75,11.75 11.75,23.18 | IC1.13 11.75,23.18 | 11.75,23.18 11.43,23.18 | 11.43,23.18 IC1.12 | IC13.12 11.43,33.02 11.43,23.18 | v22.54,32.07 22.86,32.38 22.86,36.83 v23.5,37.47 23.81,37.78 v23.81,46.04 22.86,46.99 22.86,48.58 IC8.11 IC8.12 19.68,54.29 v19.68,59.37 19.68,64.77 C.1 C.2 | IC10.12 IC10.11
  Bottom 0.152: IC4.20 45.72,60.01 24.13,60.01 23.5,59.37 v19.68,59.37 | IC7.20 45.72,32.07 41.05,32.07 | IC21.20 45.72,18.1 41.05,18.1 | 41.05,32.07 42.29,33.31 48.51,33.31 IC17.20 | 41.05,18.1 42.29,19.34 48.51,19.34 IC14.20 | 41.05,46.04 42.29,47.28 48.51,47.28 IC6.20 | IC15.20 45.72,46.04 41.05,46.04 | 41.05,46.04 v23.81,46.04 | IC12.11 22.23,6.35 49.53,6.35 50.8,7.62 IC23.20 | v23.5,18.1 41.05,18.1 | IC13.12 IC13.13 16.51,37.47 v23.5,37.47 | v22.54,32.07 41.05,32.07 | IC10.11 11.11,51.12 19.05,51.12 20,50.16 IC8.11 | IC12.12 20,11.11 11.11,11.11 IC11.12